# EAGLE design LED Display (EAGLE 7.7.0)
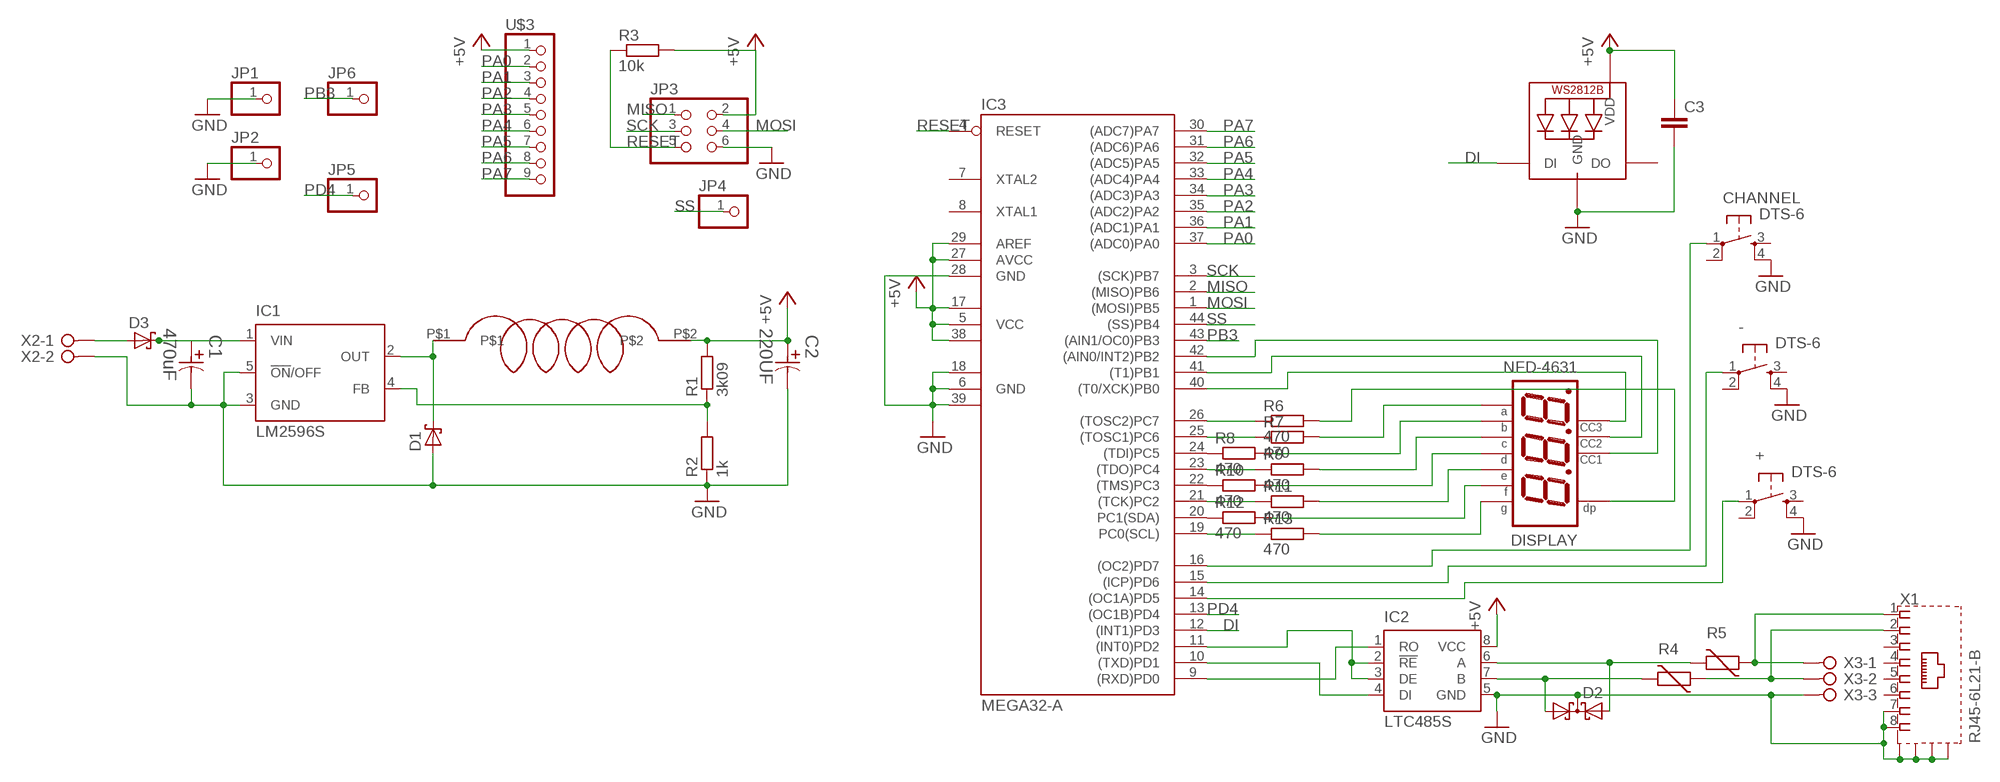
[diagram p0: schematic, sheet 1]

## Parts
+  DTS-6  [DTS-6]
-  DTS-6  [DTS-6]
C1  470uF  EEE-FT1V561AP-CASE-G  [CAPAE1030X1050N]
C2  220UF  EEE-FT1C221AP-CASE-D  [CAPAE660X610N]
C3  C-EUC0805  [C0805]
CHANNEL  DTS-6  [DTS-6]
D1  MBRS130LT3  [SMB]
D2  BAS40-05  [SOT23]
D3  MBRS130LT3  [SMB]
DISPLAY  NFD-4631  [NFD-5631]
IC1  LM2596S  [TO263-5]
IC2  LTC485S  [SOIC8]
IC3  MEGA32-A  [TQFP44]
JP1  PINHD-1X1CB  [1X01-CLEANBIG]
JP2  PINHD-1X1CB  [1X01-CLEANBIG]
JP3  PINHD-2X3  [2X03]
JP4  PINHD-1X1  [1X01]
JP5  PINHD-1X1CB  [1X01-CLEANBIG]
JP6  PINHD-1X1CB  [1X01-CLEANBIG]
LED1  WS2812B5050  [WS2812B]
R1  3k09  R-EU_M0805  [M0805]
R2  1k  R-EU_M0805  [M0805]
R3  10k  R-EU_M0805  [M0805]
R4  VARISTORCN1812  [CT/CN1812]
R5  VARISTORCN1812  [CT/CN1812]
R6  470  R-EU_M0805  [M0805]
R7  470  R-EU_M0805  [M0805]
R8  470  R-EU_M0805  [M0805]
R9  470  R-EU_M0805  [M0805]
R10  470  R-EU_M0805  [M0805]
R11  470  R-EU_M0805  [M0805]
R12  470  R-EU_M0805  [M0805]
R13  470  R-EU_M0805  [M0805]
U$1  SRN8040  [SRN8040]
U$3  PINHD-1X9  [1X09-BIG]
X1  RJ45-6L21-B  [RJ45-SHIELD1]
X2  W237-02P  [W237-132]
X3  W237-03P  [W237-133]

## Nets
+5V: C2.1 C3.1 IC2.8(VCC) IC3.5(VCC) IC3.17(VCC1) IC3.27(AVCC) IC3.29(AREF) IC3.38(VCC2) JP3.2 LED1.1-VDD(VDD) R1.2 R3.2 U$1.P$2 U$3.1
DI: IC3.12((INT1)PD3) LED1.4-DIN(DI)
GND: +.4 -.4 C1.2 C2.2 C3.2 CHANNEL.4 D1.A D2.3(C) IC1.3(GND) IC1.5(!ON!/OFF) IC2.5(GND) IC3.6(GND) IC3.18(GND1) IC3.28(GND) IC3.39(GND2) JP1.1 JP2.1 JP3.6 LED1.3-GND(GND) R2.1 X1.7 X1.8 X1.S1(S) X1.S2(S) X1.S3(S) X1.S4(S) X2.2 X3.3
MISO: IC3.2((MISO)PB6) JP3.1
MOSI: IC3.1((MOSI)PB5) JP3.4
N$1: C1.1 D3.C IC1.1(VIN)
N$2: D2.1(A1) IC2.7(B) R4.2
N$3: IC1.4(FB) R1.1 R2.2
N$4: D1.C IC1.2(OUT) U$1.P$1
N$5: D2.2(A2) IC2.6(A) R5.2
N$6: IC2.2(!RE) IC2.3(DE) IC3.11((INT0)PD2)
N$7: IC2.1(RO) IC3.9((RXD)PD0)
N$8: IC2.4(DI) IC3.10((TXD)PD1)
N$9: R4.1 X1.2 X3.2
N$10: R5.1 X1.1 X3.1
N$12: IC3.26((TOSC2)PC7) R6.1
N$14: +.1 IC3.14((OC1A)PD5)
N$15: DISPLAY.P$5(P$G) R13.2
N$16: DISPLAY.P$10(P$F) R12.2
N$17: DISPLAY.P$1(P$E) R11.2
N$18: DISPLAY.P$2(P$D) R10.2
N$19: DISPLAY.P$4(P$C) R9.2
N$20: DISPLAY.P$7(P$B) R8.2
N$21: DISPLAY.P$11(P$A) R7.2
N$22: DISPLAY.P$3(P$DP) R6.2
N$23: DISPLAY.P$12(P$CC1) IC3.42((AIN0/INT2)PB2)
N$24: DISPLAY.P$9(P$CC2) IC3.41((T1)PB1)
N$26: -.1 IC3.15((ICP)PD6)
N$27: CHANNEL.1 IC3.16((OC2)PD7)
N$29: IC3.24((TDI)PC5) R8.1
N$30: IC3.22((TMS)PC3) R10.1
N$31: IC3.20(PC1(SDA)) R12.1
N$32: IC3.19(PC0(SCL)) R13.1
N$33: IC3.21((TCK)PC2) R11.1
N$34: IC3.23((TDO)PC4) R9.1
N$35: IC3.25((TOSC1)PC6) R7.1
N$37: DISPLAY.P$8(P$CC3) IC3.40((T0/XCK)PB0)
N$41: D3.A X2.1
PA0: IC3.37((ADC0)PA0) U$3.2
PA1: IC3.36((ADC1)PA1) U$3.3
PA2: IC3.35((ADC2)PA2) U$3.4
PA3: IC3.34((ADC3)PA3) U$3.5
PA4: IC3.33((ADC4)PA4) U$3.6
PA5: IC3.32((ADC5)PA5) U$3.7
PA6: IC3.31((ADC6)PA6) U$3.8
PA7: IC3.30((ADC7)PA7) U$3.9
PB3: IC3.43((AIN1/OC0)PB3) JP6.1
PD4: IC3.13((OC1B)PD4) JP5.1
RESET: IC3.4(RESET) JP3.5 R3.1
SCK: IC3.3((SCK)PB7) JP3.3
SS: IC3.44((SS)PB4) JP4.1
Unconnected: +.2 +.3 -.2 -.3 CHANNEL.2 CHANNEL.3 IC3.7(XTAL2) IC3.8(XTAL1) LED1.2-DOUT(DO) X1.3 X1.4 X1.5 X1.6

## Library data of the parts
+ - CHANNEL = switch-tact:DTS-6
C1 = Panasonic-EEEFT_EEEH:EEE-: Aluminum Electrolytic Capacitors,Surface Mount Type; OC_FARNELL: 2309060RL; PACKAGE: CASE-G; TOLERANCE: ±20 %; VALUE: 560UF; VOLTAGERATING: 35V
C2 = Panasonic-EEEFT_EEEH:EEE-: Aluminum Electrolytic Capacitors,Surface Mount Type; MPN: EEE-FT1C221AP; OC_FARNELL: 2065971; OC_NEWARK: 73T9159; PACKAGE: CASE-D; SUPPLIER: PANASONIC; TOLERANCE: ±20 %; VOLTAGERATING: 16V
C3 = resistor:C-EU: CAPACITOR, European symbol
D1 D3 = diode:MBRS130LT3: Schottky Power Rectifier Source: http://www.onsemi.com/pub/Collateral/MBRS130LT3-D.PDF; FARNEL: 2101194
D2 = diode:BAS40-05: Silicon Schottky Diodes General-purpose diode for high-speed switching; FARNEL: 1824869
DISPLAY = display-nfd:NFD-4631
IC1 = national-semiconductor:LM2596: SIMPLE SWITCHER® Power Converter 150 kHz 3A Step-Down Voltage Regulator Source: http://www.national.com/ds/LM/LM2596.pdf; MF: NATIONAL SEMICONDUCTOR; MPN: LM2596S-ADJ/NOPB; OC_FARNELL: 9494367; OC_NEWARK: 41K3842
IC2 = linear-technology:LTC485: Low Power RS485 Interface Transceiver Source: http://www.linear.com/pc/downloadDocument.do?navId=H0,C1,C1007,C1017,P2064,D1718; OC_FARNELL: 1564306; OC_NEWARK: unknown
IC3 = atmel:MEGA32: MICROCONTROLLER 32 Kbytes FLASH 2 Kbytes SRAM 1 Kbytes EEPROM USART 8-channel 10 bit ADC Source: www.atmel.com .. doc2503.pdf; MPN: ATMEGA32-16AU; OC_FARNELL: 9171274; OC_NEWARK: 69K6677
JP1 JP2 JP5 JP6 = adafruit:PINHD-1X1: Pin header 1x1 for 0.1" spacing With round pins
JP3 = pinhead:PINHD-2X3: PIN HEADER
JP4 = pinhead:PINHD-1X1: PIN HEADER
LED1 = adafruit:WS2812B
R1 = resistor:R-EU_: RESISTOR, European symbol; FARNEL: 2502845
R2 = resistor:R-EU_: RESISTOR, European symbol; FARNEL: 9237496
R3 R6-R13 = resistor:R-EU_: RESISTOR, European symbol
R4 R5 = varistor:VARISTOR: VARISTOR; FARNELL: 1652168
U$1 = Extras:SRN8040
U$3 = adafruit:PINHD-1X9: Pin header 1x10 0.1" spacing With round pins
X1 = con-tycoelectronics:RJ45*2: RJ45 Low Profile Shield Type 2 For all RJ45 L, LC, LCT and X Series Models Source: www.tycoelectronics.com .. ENG_DS_1654001_1099_RJ_L_0507.pdf; OC_FARNELL: unknown; OC_NEWARK: unknown
X2 = con-wago-508:W237-02P: WAGO SREW CLAMP; OC_FARNELL: unknown; OC_NEWARK: unknown
X3 = con-wago-508:W237-03P: WAGO SREW CLAMP; OC_FARNELL: unknown; OC_NEWARK: unknown

## Board
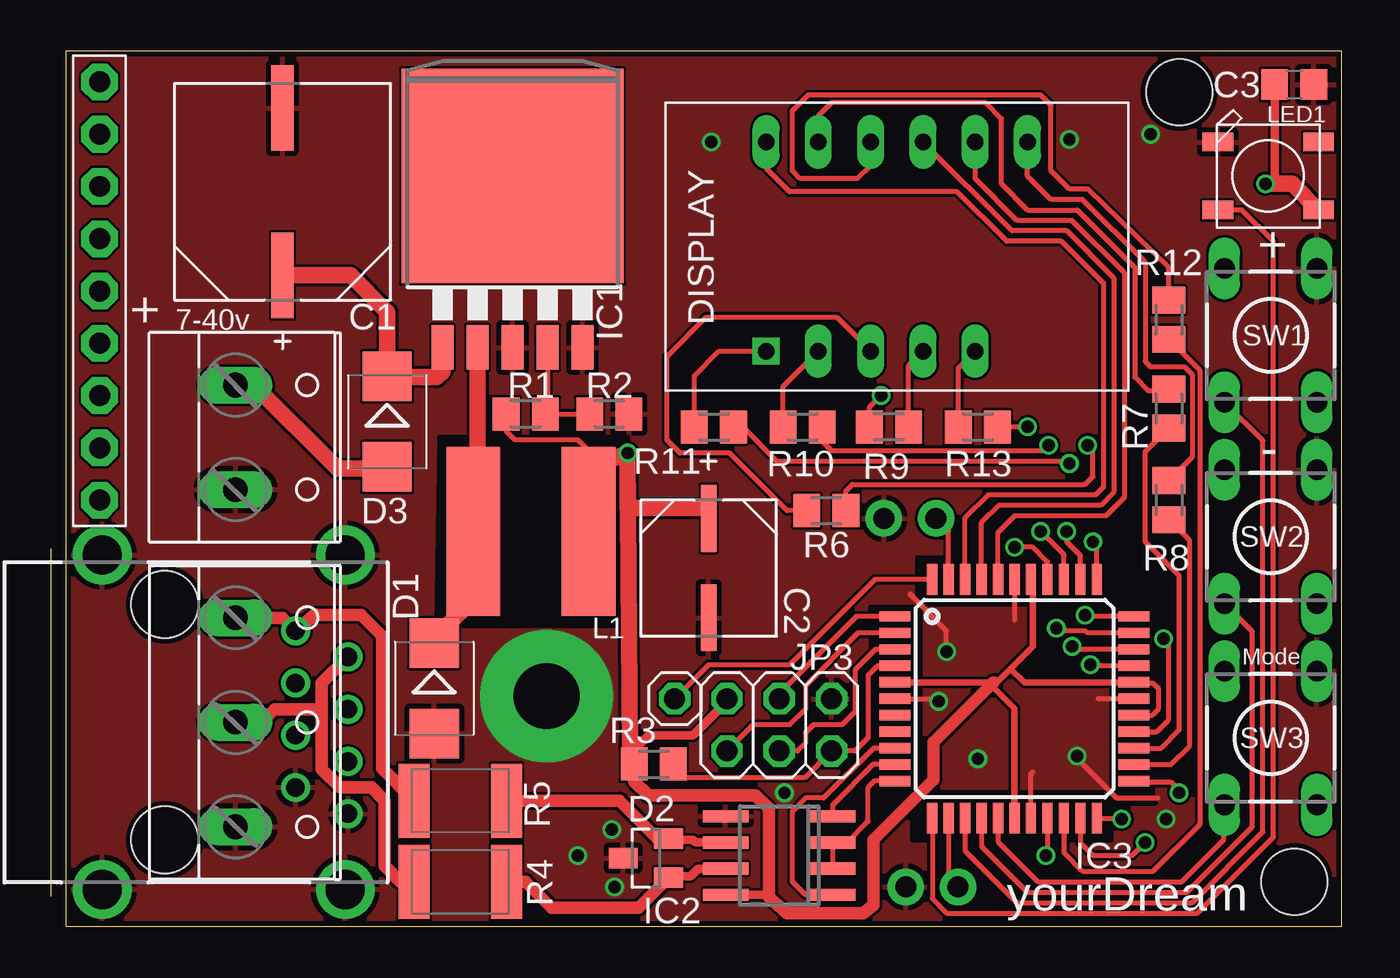
[diagram p1: board, top side]
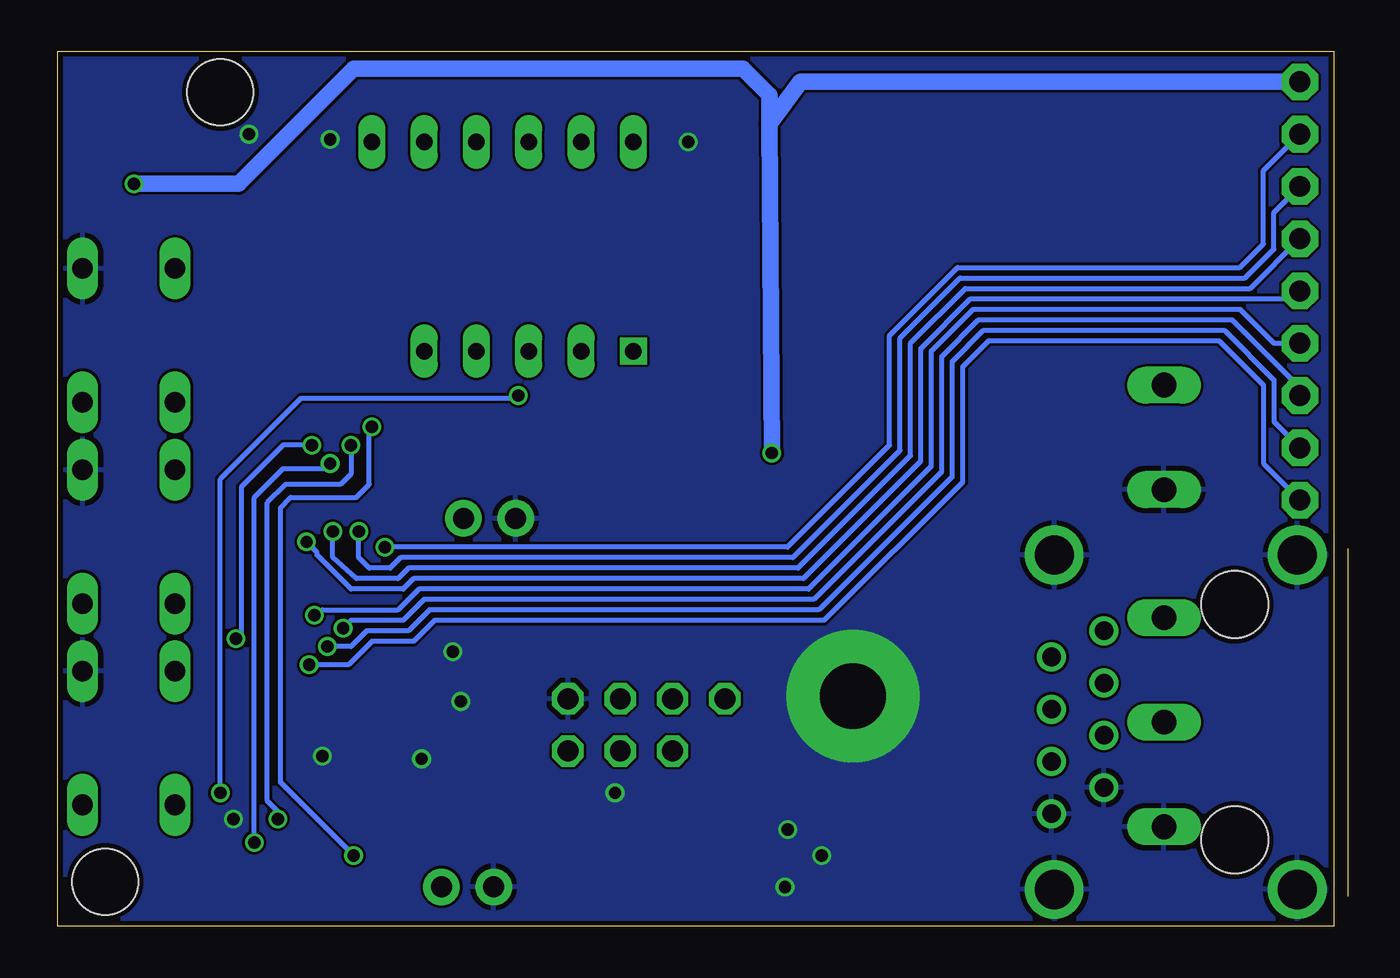
[diagram p2: board, bottom side, seen from below]

Size 62 x 42.5 mm. Coordinates in mm from the lower left corner, seen from the top.
Outline: 0,0 62,0 62,42.5 0,42.5 0,0
Copper layers (1*16): Top 0.035mm / dielectric 1.5mm / Bottom 0.035mm
Design rules "dirt_cheap_dirty_boards.v1": minimum track width 5mil, minimum drill 12mil, track to track 5mil, track to pad 5mil, pad to pad 5mil, via to via 5mil, smd to smd 0mil, copper to edge 10mil, drill to drill 10mil, minimum pad ring 10mil, minimum via ring 6mil, stop-mask expansion 2mil, vias tented up to drill 25mil, thermal gap 10mil
Holes 3.2 mm at 59.69,2.16 54.1,40.51

### Footprints (pad centres in the part's own frame; a part is rotated, then mirrored left to right if it is on the bottom)
DTS-6 = drill 1 long: 1 -3.25,2.25; 2 3.25,2.25; 3 -3.25,-2.25; 4 3.25,-2.25
CAPAE1030X1050N = smd 4.166 x 1.092: 1 -4.064,0; 2 4.064,0
CAPAE660X610N = smd 3.251 x 0.762: 1 -2.413,0; 2 2.413,0
C0805 = smd 1.3 x 1.5: 1 -0.95,0; 2 0.95,0
SMB = smd 2.4 x 2.4: A 2.2,0; C -2.2,0
SOT23 = smd 1 x 1.4: 1 -0.95,-1.1; 2 0.95,-1.1; 3 0,1.1
NFD-5631 = drill 0.8 square: P$1 -6.35,-5.08 | drill 0.8 long: P$2 -3.81,-5.08; P$3 -1.27,-5.08; P$4 1.27,-5.08; P$5 3.81,-5.08; P$7 6.35,5.08; P$8 3.81,5.08; P$9 1.27,5.08; P$10 -1.27,5.08; P$11 -3.81,5.08; P$12 -6.35,5.08
TO263-5 = smd 1.067 x 2.159: 1 -3.404,-5.791; 2 -1.702,-5.791; 3 0,-5.791; 4 1.702,-5.791; 5 3.404,-5.791 | smd 10.8 x 10.41: 6 0,2.54
SOIC8 = smd 0.6 x 2.2: 1 -1.905,-2.6; 2 -0.635,-2.6; 3 0.635,-2.6; 4 1.905,-2.6; 5 1.905,2.6; 6 0.635,2.6; 7 -0.635,2.6; 8 -1.905,2.6
TQFP44 = smd 1.5 x 0.5: 1 -5.8,4; 2 -5.8,3.2; 3 -5.8,2.4; 4 -5.8,1.6; 5 -5.8,0.8; 6 -5.8,0; 7 -5.8,-0.8; 8 -5.8,-1.6; 9 -5.8,-2.4; 10 -5.8,-3.2; 11 -5.8,-4; 23 5.8,-4; 24 5.8,-3.2; 25 5.8,-2.4; 26 5.8,-1.6; 27 5.8,-0.8; 28 5.8,0; 29 5.8,0.8; 30 5.8,1.6; 31 5.8,2.4; 32 5.8,3.2; 33 5.8,4 | smd 0.5 x 1.5: 12 -4,-5.8; 13 -3.2,-5.8; 14 -2.4,-5.8; 15 -1.6,-5.8; 16 -0.8,-5.8; 17 0,-5.8; 18 0.8,-5.8; 19 1.6,-5.8; 20 2.4,-5.8; 21 3.2,-5.8; 22 4,-5.8; 34 4,5.8; 35 3.2,5.8; 36 2.4,5.8; 37 1.6,5.8; 38 0.8,5.8; 39 0,5.8; 40 -0.8,5.8; 41 -1.6,5.8; 42 -2.4,5.8; 43 -3.2,5.8; 44 -4,5.8
1X01-CLEANBIG = drill 1.016 pad 1.778: 1 0,0
2X03 = drill 1.016 octagon: 1 -2.54,-1.27; 2 -2.54,1.27; 3 0,-1.27; 4 0,1.27; 5 2.54,-1.27; 6 2.54,1.27
1X01 = drill 1.016 octagon: 1 0,0
WS2812B = smd 1.5 x 0.9: 1-VDD 2.45,-1.65; 2-DOUT 2.45,1.65; 3-GND -2.45,1.65; 4-DIN -2.45,-1.65
M0805 = smd 1.3 x 1.6: 1 -0.95,0; 2 0.95,0
CT/CN1812 = smd 1.5 x 3.6: 1 -2.25,0; 2 2.25,0
SRN8040 = smd 2.6 x 8.2: P$1 -2.8,0; P$2 2.8,0
1X09-BIG = drill 1.016 pad 1.778 octagon: 1 -10.16,0; 2 -7.62,0; 3 -5.08,0; 4 -2.54,0; 5 0,0; 6 2.54,0; 7 5.08,0; 8 7.62,0; 9 10.16,0
RJ45-SHIELD1 = drill 0.9 pad 1.4: 1 -4.445,6.35; 2 -3.175,8.89; 3 -1.905,6.35; 4 -0.635,8.89; 5 0.635,6.35; 6 1.905,8.89; 7 3.175,6.35; 8 4.445,8.89 | drill 1.9 pad 2.5: S1 -8.128,-3.048; S2 8.128,-3.048; S3 -8.128,8.76; S4 8.128,8.76 | hole 3.251: -5.715,0; 5.715,0
W237-132 = drill 1.194 long: 1 -2.54,-0.635; 2 2.54,-0.635
W237-133 = drill 1.194 long: 1 -5.08,-0.635; 2 0,-0.635; 3 5.08,-0.635

### Placement (x,y rotation side)
+  58.55,28.7 90 top
-  58.55,18.92 90 top
C1  10.54,35.69 90 top
C2  31.24,17.4 270 top
C3  59.69,40.89 0 top
CHANNEL  58.55,9.14 90 top
D1  17.91,11.56 270 top
D2  28.19,3.3 90 top
D3  15.62,24.51 270 top
DISPLAY  40.39,33.02 0 top
IC1  21.72,33.91 0 top
IC2  34.67,3.43 90 top
IC3  46.1,11.05 0 top
JP1  39.75,19.81 0 top
JP2  40.82,1.91 0 top
JP3  34.67,9.78 0 top
JP4  29.59,11.05 0 top
JP5  43.36,1.91 0 top
JP6  42.29,19.81 0 top
LED1  58.42,36.45 0 top
R1  22.35,24.89 180 top
R2  26.42,24.89 180 top
R3  28.57,7.87 180 top
R4  19.18,2.16 0 top
R5  19.18,6.1 0 top
R6  36.96,20.19 180 top
R7  53.59,25.15 90 top
R8  53.59,20.7 90 top
R9  40.01,24.26 0 top
R10  35.81,24.26 180 top
R11  31.5,24.26 180 top
R12  53.59,29.46 90 top
R13  44.32,24.26 180 top
U$1  22.61,19.18 0 top
U$3  1.65,30.86 270 top
X1  4.83,9.91 270 top
X2  8.89,23.75 270 top
X3  8.89,9.91 270 top

### Tracks (layer width: path | path; a pad name or v marks a point on that pad's centre or on a via)
+5V  (via drill 0.6)
  Top 0.254: IC3.29 51.94,11.81 52.83,11.81 53.09,11.56 53.09,10.54 52.79,10.25 IC3.27 | 26.29,22.86 25.65,22.86 24.89,23.62 21.84,23.62 21.4,24.06 R1.2 | 31.11,20.32 31.11,19.94 C2.1
  Top 0.305: IC3.5 44.83,11.85 | 44.83,11.85 45.09,11.85 45.25,11.85 45.91,12.51 | 45.91,12.51 46.99,13.59 46.99,16.76 IC3.38 | IC3.29 46.57,11.85 45.91,12.51 | IC3.17 46.1,10.58 44.83,11.85
  Top 0.406: JP3.2 32.13,10.92 30.48,9.27 28.32,9.27 27.94,8.89 27.37,8.13 | IC2.8 34.04,1.52 34.16,1.4 | 58.17,35.94 v58.29,36.07 | C3.1 58.74,36.13 58.8,36.07
  Top 0.61: 45.09,11.85 42.16,8.93 42.16,7.11 39.24,4.19 39.24,1.02 38.73,0.64 35.05,0.64 34.16,1.4 34.16,5.71 33.53,6.35 28.32,6.35 27.62,7.05 R3.2 27.43,8.07 | 25.4,21.59 25.4,21.97 26.29,22.86 | 27.43,8.38 27.43,8.07 | 27.43,8.07 27.37,8.13
  Top 0.813: v58.29,36.07 58.8,36.07 59.6,36.07 LED1.1-VDD | v27.3,22.99 25.4,22.23 25.4,21.59 25.4,18.66 U$1.P$2 | v27.3,22.99 27.3,20.32 31.11,20.32 | 27.43,8.38 v27.3,22.99
  Bottom 0.813: 27.43,38.99 27.43,40.39 28.7,41.66 47.62,41.66 53.21,36.07 v58.29,36.07 | U$3.1 25.91,41.02 27.43,38.99 | 27.43,38.99 v27.3,22.99
DI
  Top 0.254: IC3.12 42.1,1.33 42.8,0.64 54.99,0.64 58.67,4.32 58.67,33.27 57.15,34.8 LED1.4-DIN
GND  (via drill 0.6, 3.2 pad 6.45)
  Top 0.254: IC3.18 46.9,7.4 46.99,7.49 | IC3.28 50.16,11.05 | v49.15,8.26 49.15,8.13 51.05,6.22 53.09,6.22 | v42.8,13.34 42.8,14.35 41.02,16.13 | IC3.39 46.1,14.86 | IC3.6 42.29,11.05 v42.42,10.92
  other vias: 44.32,8.13 53.47,5.21 31.37,38.1 52.7,38.48 26.54,4.7 26.67,1.91 34.92,6.48 23.37,11.18 48.77,38.23 24.89,3.43
  pour Top (rank 3): 0,0 62.23,0 62.23,43.18 0,43.18
  pour Bottom (rank 3): 0,0 62.23,0 62.23,43.18 0,43.18
MISO
  Top 0.254: IC3.2 38.51,14.25 35.94,11.68 35.94,10.54 35.18,9.78 33.4,9.78 JP3.1
MOSI
  Top 0.254: IC3.1 38.42,15.05 34.92,11.56 34.92,11.3 JP3.4
N$1
  Top 0.813: IC1.1 18.31,26.95 18.03,26.67 15.66,26.67 D3.C 15.62,29.84 13.84,31.62 C1.1
N$2
  Top 0.406: IC2.7 30.73,2.79 30.35,2.41 29.36,2.41 D2.1
  Top 0.61: 29.34,2.31 D2.1 27.83,0.89 23.62,0.89 22.35,2.16 R4.2
N$3
  Top 0.254: R2.2 R1.1 23.42,25.01 IC1.4
N$4
  Top 0.813: IC1.2 20.02,18.88 U$1.P$1 19.18,18.55 19.18,15.24 17.91,13.97 D1.C
N$5
  Top 0.406: IC2.6 30.61,4.06 30.48,4.19 29.36,4.19 D2.2
  Top 0.61: 29.21,4.34 D2.2 28.77,4.25 26.92,6.1 R5.2
N$6
  Top 0.254: IC2.2 IC2.3 37.97,4.06 38.99,5.08 38.99,6.73 39.31,7.05 IC3.11
N$7
  Top 0.254: IC3.9 39.26,8.65 36.83,6.22 35.94,6.22 35.31,5.59 35.31,2.16 35.94,1.52 IC2.1
N$8
  Top 0.254: IC3.10 39.22,7.85 37.27,5.9 IC2.4
N$9
  Top 0.61: 12.45,10.54 12.45,7.62 13.34,6.73 14.86,6.73 15.49,6.1 15.49,2.92 16.26,2.16 R4.1 | 12.45,10.54 12.45,11.81 X1.2 | X3.2 9.53,9.91 10.16,10.54 12.45,10.54
N$10
  Top 0.61: R5.1 15.37,7.66 15.37,14.1 14.35,15.11 12.06,15.11 X1.1 10.54,14.99 X3.1
N$12  (via drill 0.6)
  Top 0.254: IC3.26 53.01,9.45 53.59,10.03 53.59,13.72 v53.34,13.97 | R6.1 37.91,21.14 38.23,21.46 49.53,21.46 49.91,21.84 49.91,23.11 v49.66,23.37
  Bottom 0.254: v49.66,23.37 51.05,23.37 53.09,21.34 53.09,14.22 v53.34,13.97
N$13
  cutout Top: 18.16,23.75 18.03,14.61 27.18,14.61 27.3,23.75
N$14
  Top 0.254: IC3.14 43.7,3.67 46.23,1.14 54.74,1.14 58.17,4.57 58.17,23.58 +.1
N$15
  Top 0.254: R13.2 43.37,27.12 DISPLAY.P$5
N$16
  Top 0.254: DISPLAY.P$10 39.12,36.96 38.48,36.32 35.69,36.32 35.31,36.7 35.31,39.62 36.07,40.39 47.37,40.39 47.88,39.88 47.88,36.7 48.77,35.81 49.66,35.81 53.59,32 R12.2
N$17
  Top 0.254: R11.2 30.55,26.74 31.75,27.94 DISPLAY.P$1
N$18
  Top 0.254: R10.2 34.86,26.23 DISPLAY.P$2
N$19
  Top 0.254: R9.2 40.95,27.24 DISPLAY.P$4
N$20
  Top 0.254: 53.21,22.1 R8.2 54.74,22.79 54.74,26.8 54.36,27.18 52.7,27.18 52.45,27.43 52.45,32.26 49.4,35.31 47.88,35.31 46.74,36.45 DISPLAY.P$7
N$21
  Top 0.254: DISPLAY.P$11 36.58,39.37 37.21,40.01 44.7,40.01 45.47,39.24 45.47,36.07 46.74,34.8 49.15,34.8 51.94,32 51.94,26.67 52.58,26.04 53.15,26.04 R7.2
N$22
  Top 0.254: R6.2 35.05,20.19 32.26,22.99 29.84,22.99 29.21,23.62 29.21,27.69 31.11,29.59 37.47,29.59 DISPLAY.P$3
N$23
  Top 0.254: IC3.42 43.7,19.82 44.83,20.95 50.04,20.95 50.42,21.34 50.42,31.24 48.39,33.27 45.72,33.27 43.31,35.69 35.18,35.69 34.04,36.83 DISPLAY.P$12
N$24
  Top 0.254: IC3.41 44.5,19.61 45.34,20.45 50.29,20.45 50.93,21.08 50.93,31.5 48.64,33.78 45.97,33.78 DISPLAY.P$9
N$25
  cutout Top: 52.83,15.62 50.8,15.62 50.8,6.48 41.53,6.48 41.53,15.49 39.12,15.49 39.12,6.22 41.15,6.22 41.15,4.19 50.8,4.19 50.8,5.97 52.96,5.97 52.83,5.97
N$26
  Top 0.254: IC3.15 44.5,3.89 46.74,1.65 54.48,1.65 57.66,4.83 57.66,14.31 -.1
N$27
  Top 0.254: IC3.16 45.3,4.1 47.24,2.16 54.23,2.16 56.26,4.19 56.26,5.86 CHANNEL.1
N$28
  cutout Top: 41.4,17.91 50.8,17.91 50.8,15.62 41.4,15.62
N$29
  Top 0.254: IC3.24 53.7,7.85 54.61,8.76 54.61,18.73 R8.1
N$30  (via drill 0.6)
  Top 0.254: IC3.22 51.27,5.25 v51.31,5.21 | R10.1 36.7,24.2 36.7,23.62 37.21,23.11 47.5,23.11 v47.75,23.37
  Bottom 0.254: v51.31,5.21 51.31,5.59 51.82,6.1 51.82,20.57 50.93,21.46 48.26,21.46 47.75,21.97 v47.75,23.37
N$31
  Top 0.254: IC3.20 48.51,5.24 48.51,3.56 49.4,2.67 52.83,2.67 55.12,4.95 55.12,26.99 R12.1
N$32  (via drill 0.6)
  Top 0.254: IC3.19 47.7,3.5 v47.62,3.43 | v46.74,24.26 R13.1
  Bottom 0.254: v46.74,24.26 46.86,24.13 46.86,21.46 47.5,20.83 50.67,20.83 51.18,20.32 51.18,6.99 v47.62,3.43
N$33  (via drill 0.6)
  Top 0.254: IC3.21 49.3,4.04 49.91,3.43 51.82,3.43 v52.45,4.06 | R11.1 32.38,24.2 32.95,24.2 34.54,22.61 48.64,22.61 v48.77,22.48
  Bottom 0.254: v52.45,4.06 52.45,20.83 51.05,22.23 49.02,22.23 v48.77,22.48
N$34  (via drill 0.6)
  Top 0.254: R9.1 39.05,25.21 v39.62,25.78 | v54.1,6.48 54.1,6.6 53.72,6.99 51.97,6.99 IC3.23
  Bottom 0.254: v39.62,25.78 39.75,25.65 50.16,25.65 54.1,21.72 v54.1,6.48
N$35
  Top 0.254: IC3.25 53.23,8.65 54.1,9.53 54.1,17.02 52.45,18.67 52.45,23.05 R7.1
N$37
  Top 0.254: IC3.40 45.3,19.14 46.1,19.94 50.55,19.94 51.44,20.83 51.44,31.75 48.9,34.29 46.23,34.29 44.2,36.32 DISPLAY.P$8
N$41
  Top 0.813: X2.1 9.14,26.29 13.21,22.23 15.54,22.23 D3.A
PA0  (via drill 0.6)
  Top 0.254: IC3.37 47.7,17.7 46.99,18.41 v46.1,18.41
  Bottom 0.254: v46.1,18.41 26.54,18.41 21.59,23.37 21.59,28.7 18.29,32 4.57,32 3.43,33.15 3.43,36.7 U$3.2
PA1  (via drill 0.6)
  Top 0.254: IC3.36 48.5,18.05 v47.37,19.18
  Bottom 0.254: v47.37,19.18 47.37,17.91 46.86,17.4 45.85,17.4 45.34,17.91 26.29,17.91 21.08,23.11 21.08,28.57 18.16,31.5 4.32,31.5 2.92,32.89 2.92,34.67 U$3.3
PA2  (via drill 0.6)
  Top 0.254: IC3.35 49.3,18.01 48.64,18.67 v48.64,19.18
  Bottom 0.254: v48.64,19.18 48.64,17.91 47.5,16.89 45.47,16.89 44.96,17.4 26.04,17.4 20.57,22.86 20.57,28.32 17.91,30.99 4.06,30.99 U$3.4
PA3  (via drill 0.6)
  Top 0.254: IC3.34 50.1,18.48 v49.91,18.67
  Bottom 0.254: v49.91,18.67 49.4,18.16 49.4,18.03 47.75,16.38 45.21,16.38 44.7,16.89 25.78,16.89 20.07,22.61 20.07,28.07 17.65,30.48 2.03,30.48 U$3.5
PA4  (via drill 0.6)
  Top 0.254: IC3.33 49.59,15.05 v49.53,15.11
  Bottom 0.254: v49.53,15.11 49.4,15.11 49.15,15.37 45.47,15.37 44.45,16.38 25.53,16.38 19.56,22.35 19.56,27.94 17.53,29.97 4.57,29.97 2.92,28.32 U$3.6
PA5  (via drill 0.6)
  Top 0.254: IC3.32 49.63,14.25 49.53,14.35 48.26,14.35 v48.13,14.48
  Bottom 0.254: 48.26,14.35 v48.13,14.48 47.75,14.86 45.21,14.86 44.2,15.88 25.27,15.88 19.05,22.1 19.05,27.69 17.27,29.46 4.95,29.46 1.78,26.29 1.78,25.91 U$3.7
PA6  (via drill 0.6)
  Top 0.254: IC3.31 49.03,13.45 v48.9,13.59
  Bottom 0.254: 48.77,13.59 v48.9,13.59 47.75,13.59 46.99,14.35 44.96,14.35 43.94,15.37 25.02,15.37 18.54,21.84 18.54,27.43 17.02,28.96 5.33,28.96 2.92,26.54 2.92,24.51 U$3.8
PA7  (via drill 0.6)
  Top 0.254: IC3.30 49.84,12.65 v49.78,12.7
  Bottom 0.254: U$3.9 3.43,22.48 3.43,26.29 5.59,28.45 16.76,28.45 18.03,27.18 18.03,21.59 24.77,14.86 43.69,14.86 44.7,13.84 46.74,13.84 47.88,12.7 v49.78,12.7
PB3
  Top 0.254: IC3.43 42.9,19.2 JP6.1
PD4
  Top 0.254: IC3.13 42.9,2.36 JP5.1
RESET
  Top 0.254: IC3.4 39.45,12.65 38.99,12.19 38.99,9.14 38.35,8.51 JP3.5 35.94,7.24 30.16,7.24 R3.1
SCK
  Top 0.254: IC3.3 39.36,13.45 38.35,12.45 38.35,10.41 37.72,9.78 36.32,9.78 35.94,9.4 35.94,8.89 35.56,8.51 JP3.3
SS
  Top 0.254: IC3.44 39.33,16.85 35.18,12.7 31.24,12.7 JP4.1

### Text on the board
tNames: + | + | 7-40v | SW1 | - | SW2 | L1 | Mode | SW3 | yourDream